# EAGLE design SparkFun_GNSS_Timing-ZED-F9T (EAGLE 9.6.2)
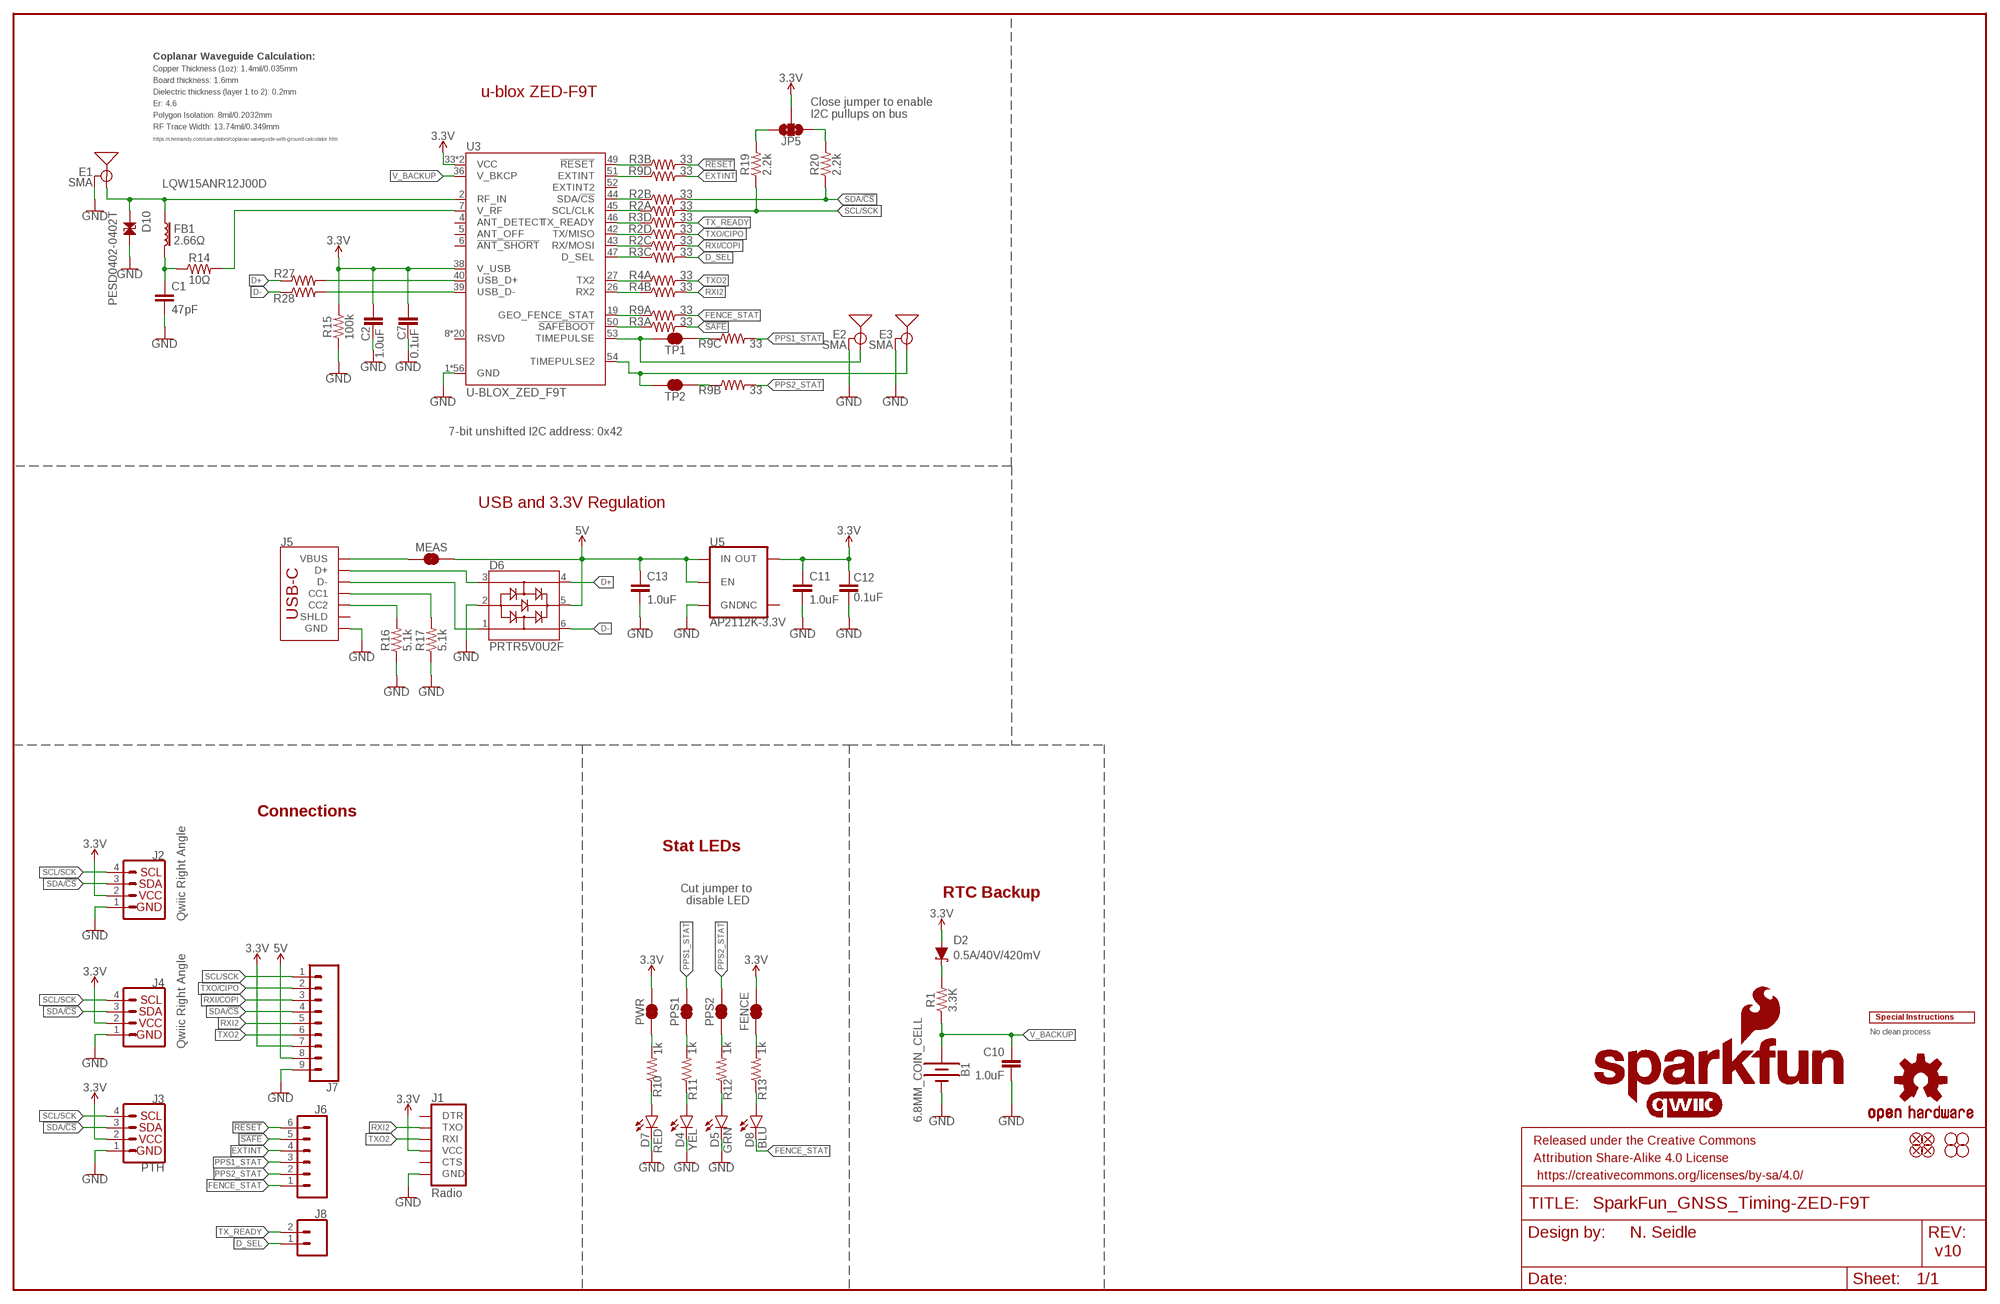
[diagram p0: schematic, sheet 1]

## Parts
B1  6.8MM_COIN_CELL  ML414H_IV01E_BATTERY  [ML414H_IV01E]
C1  47pF  47PF-0402_TIGHT-25V-5%-X7R  [0402-TIGHT]
C2  1.0uF  1.0UF-0402T-16V-10%  [0402-TIGHT]
C7  0.1uF  0.1UF-0402T-16V-10%  [0402-TIGHT]
C10  1.0uF  1.0UF-0402T-16V-10%  [0402-TIGHT]
C11  1.0uF  1.0UF-0402T-16V-10%  [0402-TIGHT]
C12  0.1uF  0.1UF-0402T-6.3V-10%-X7R  [0402-TIGHT]
C13  1.0uF  1.0UF-0402T-16V-10%  [0402-TIGHT]
D2  0.5A/40V/420mV  DIODE-SCHOTTKY-PMEG4005EJ  [SOD-323]
D4  YEL  LED-YELLOW0603  [LED-0603]
D5  GRN  LED-GREEN0603  [LED-0603]
D6  PRTR5V0U2F  [SOT886]
D7  RED  LED-RED0603  [LED-0603]
D8  BLU  LED-BLUE0603  [LED-0603]
D10  PESD0402-0402T  [0402-TIGHT]
E1  SMA  ANTENNA-SMA-GROUNDEDEDGE_SMA  [SMA-EDGE]
E2  SMA  ANTENNA-SMA-GROUNDEDEDGE_SMA  [SMA-EDGE]
E3  SMA  ANTENNA-SMA-GROUNDEDEDGE_SMA  [SMA-EDGE]
FB1  2.66Ω  FERRITE_BEAD-0402-2.66Ω-1GHZ  [0402-TIGHT]
FENCE  JUMPER-SMT_2_NC_TRACE_SILK  [SMT-JUMPER_2_NC_TRACE_SILK]
FRAME2  FRAME-LEDGER  [CREATIVE_COMMONS]
H1  STAND-OFF  [STAND-OFF]
H2  STAND-OFF  [STAND-OFF]
H3  STAND-OFF  [STAND-OFF]
H4  STAND-OFF  [STAND-OFF]
J1  Radio  6_PIN_SERIAL_TARGET_NO_SILK  [1X06_NO_SILK]
J2  Qwiic Right Angle  I2C_STANDARDQWIIC  [JST04_1MM_RA]
J3  PTH  I2C_STANDARD_NO_SILK  [1X04_NO_SILK]
J4  Qwiic Right Angle  I2C_STANDARDQWIIC  [JST04_1MM_RA]
J5  USB Female Type C Connector  USB_C_4-LAYER_PADS  [USB-C-16P_4LAYER-PADS]
J6  CONN_06NO_SILK_FEMALE_PTH  [1X06_NO_SILK]
J7  CONN_09NO_SILK  [1X09_NO_SILK]
J8  CONN_021X02_NO_SILK  [1X02_NO_SILK]
JP5  JUMPER-SMT_3_NO_SILK  [SMT-JUMPER_3_NO_SILK]
JP21  FIDUCIALUFIDUCIAL  [FIDUCIAL-MICRO]
JP61  FIDUCIALUFIDUCIAL  [FIDUCIAL-MICRO]
JP71  FIDUCIALUFIDUCIAL  [FIDUCIAL-MICRO]
JP81  FIDUCIALUFIDUCIAL  [FIDUCIAL-MICRO]
LOGO1  OSHW-LOGOMINI  [OSHW-LOGO-MINI]
LOGO2  SFE_LOGO_NAME_FLAME.1_INCH  [SFE_LOGO_NAME_FLAME_.1]
LOGO4  QWIIC_LOGO_4MM  [QWIIC_4MM]
LOGO5  SFE_LOGO_NAME.1_INCH  [SFE_LOGO_NAME_.1]
MEAS  JUMPER-COMBO_2_NC_TRACE  [COMBO-JUMPER_2_NC_TRACE]
PPS1  JUMPER-SMT_2_NC_TRACE_SILK  [SMT-JUMPER_2_NC_TRACE_SILK]
PPS2  JUMPER-SMT_2_NC_TRACE_SILK  [SMT-JUMPER_2_NC_TRACE_SILK]
PWR  JUMPER-SMT_2_NC_TRACE_SILK  [SMT-JUMPER_2_NC_TRACE_SILK]
R1  3.3K  3.3KOHM-0402T-1/16W-1%  [0402-TIGHT]
R2  33  33OHM_RA-1206-1/16W-5%  [1206_RA]
R3  33  33OHM_RA-1206-1/16W-5%  [1206_RA]
R4  33  33OHM_RA-1206-1/16W-5%  [1206_RA]
R9  33  33OHM_RA-1206-1/16W-5%  [1206_RA]
R10  1k  1KOHM-0402T-1/16W-1%  [0402-TIGHT]
R11  1k  1KOHM-0402T-1/16W-1%  [0402-TIGHT]
R12  1k  1KOHM-0402T-1/16W-1%  [0402-TIGHT]
R13  1k  1KOHM-0402T-1/16W-1%  [0402-TIGHT]
R14  10Ω  10OHM-0402-1/16W-5%  [0402-TIGHT]
R15  100k  100KOHM-0402T-1/16W-1%  [0402-TIGHT]
R16  5.1k  5.1KOHM-0402T-1/16W-1%  [0402-TIGHT]
R17  5.1k  5.1KOHM-0402T-1/16W-1%  [0402-TIGHT]
R19  2.2k  2.2KOHM-0402T-1/16W-1%  [0402-TIGHT]
R20  2.2k  2.2KOHM-0402T-1/16W-1%  [0402-TIGHT]
R27  27OHM  [0402-TIGHT]
R28  27OHM  [0402-TIGHT]
TP1  JUMPER-SMT_2_NC_TRACE_SILK  [SMT-JUMPER_2_NC_TRACE_SILK]
TP2  JUMPER-SMT_2_NC_TRACE_SILK  [SMT-JUMPER_2_NC_TRACE_SILK]
U3  U-BLOX_ZED_F9T  U-BLOX_ZED_F9RT  [ZED-F9X]
U5  AP2112K-3.3V  V_REG_AP2112K-3.3V  [SOT23-5]
U$2  SPECIAL_INSTRUCTIONS-ORDERING  [ORDERING_INSTRUCTIONS]

## Nets
3.3V [power]: C2.1 C7.2 C11.1 C12.2 D2.A FENCE.2 J1.4(VCC) J2.2 J3.2(VCC) J4.2 J7.7 JP5.2 PWR.2 R15.2 U3.33(VCC) U3.34(VCC) U3.38(V_USB) U5.5(OUT)
5V: C13.1 D6.5 J7.8 MEAS.2 MEAS.4 U5.1(IN) U5.3(EN)
!RESET!: J6.6 R3.P7
!RESET!_LV: R3.P2 U3.49(!RESET!)
!SAFE!: J6.5 R3.P8
!SAFE!_LV: R3.P1 U3.50(!SAFEBOOT!)
ANT_VCC: C1.1 FB1.2 R14.1
CC1: J5.A5(CC1) R17.2
CC2: J5.B5(CC2) R16.2
D+: D6.4 R27.1
D-: D6.6 R28.1
D_SEL: J8.1 R3.P6
DSEL_LV: R3.P3 U3.47(D_SEL)
EXTINT: J6.4 R9.P5
EXTINT_LV: R9.P4 U3.51(EXTINT)
FENCE_LV: R9.P1 U3.19(GEO_FENCE_STAT)
FENCE_STAT: D8.C J6.1 R9.P8
GND: B1.- C1.2 C2.2 C7.1 C10.2 C11.2 C12.1 C13.2 D4.C D5.C D6.2 D7.C D10.2 E1.GND@0(GND) E1.GND@1(GND) E1.GND@2(GND) E1.GND@3(GND) E2.GND@0(GND) E2.GND@1(GND) E2.GND@2(GND) E2.GND@3(GND) E3.GND@0(GND) E3.GND@1(GND) E3.GND@2(GND) E3.GND@3(GND) J1.6(GND) J2.1 J3.1(GND) J4.1 J5.GND J5.GND2(GND) J7.9 R15.1 R16.1 R17.1 U3.1(GND) U3.3(GND) U3.12(GND) U3.14(GND) U3.32(GND) U3.37(GND) U3.41(GND) U3.48(GND) U3.G1(GND) U3.G2(GND) U3.G3(GND) U3.G4(GND) U3.G5(GND) U3.G6(GND) U3.G7(GND) U3.G8(GND) U3.G9(GND) U3.G10(GND) U3.G11(GND) U3.G12(GND) U3.G13(GND) U3.G14(GND) U3.G15(GND) U3.G16(GND) U3.G17(GND) U3.G18(GND) U3.G19(GND) U3.G20(GND) U3.G21(GND) U3.G22(GND) U3.G23(GND) U3.G24(GND) U3.G25(GND) U3.G26(GND) U3.G27(GND) U3.G28(GND) U3.G29(GND) U3.G30(GND) U3.G31(GND) U3.G32(GND) U3.G33(GND) U3.G34(GND) U3.G35(GND) U3.G36(GND) U3.G37(GND) U3.G38(GND) U3.G39(GND) U3.G40(GND) U3.G41(GND) U3.G42(GND) U3.G43(GND) U3.G44(GND) U3.G45(GND) U3.G46(GND) U3.G47(GND) U3.G48(GND) U5.2(GND)
GPS_ANT1 [RF]: D10.1 E1.SIG(SIGNAL) FB1.1 U3.2(RF_IN)
N$2: D4.A R11.1
N$3: PPS1.1 R11.2
N$4 [power]: J5.VBUS1(VBUS) J5.VBUS2(VBUS) MEAS.1 MEAS.3
N$5: R9.P3 TP1.1
N$6: D2.C R1.2
N$7: R9.P2 TP2.1
N$11: R27.2 U3.40(USB_D+)
N$12: R28.2 U3.39(USB_D-)
N$13: R14.2 U3.7(V_RF)
N$14: D7.A R10.1
N$16: D5.A R12.1
N$17: PPS2.1 R12.2
N$18: D8.A R13.1
N$19: FENCE.1 R13.2
N$20: PWR.1 R10.2
N$21: JP5.1 R20.2
N$22: JP5.3 R19.2
PPS1_STAT: J6.3 PPS1.2 R9.P6
PPS2_STAT: J6.2 PPS2.2 R9.P7
RX1_LV: R2.P3 U3.43(RX/MOSI)
RX2_LV: R4.P2 U3.26(RX2)
RXI2: J1.3(TXO) J7.5 R4.P7
RXI/COPI: J7.3 R2.P6
SCL/SCK: J2.4 J3.4(SCL) J4.4 J7.1 R2.P8 R19.1
SCL_LV: R2.P1 U3.45(SCL/CLK)
SDA/!CS: J2.3 J3.3(SDA) J4.3 J7.4 R2.P7 R20.1
SDA_LV: R2.P2 U3.44(SDA/!CS!)
TP1_LV [RF]: E2.SIG(SIGNAL) TP1.2 U3.53(TIMEPULSE)
TP2_LV [RF]: E3.SIG(SIGNAL) TP2.2 U3.54(TIMEPULSE2)
TX1_LV: R2.P4 U3.42(TX/MISO)
TX2_LV: R4.P1 U3.27(TX2)
TX_READY: J8.2 R3.P5
TX_READY_LV: R3.P4 U3.46(TX_READY)
TXO2: J1.2(RXI) J7.6 R4.P8
TXO/CIPO: J7.2 R2.P5
UNP_D+: D6.3 J5.A6(D+) J5.B6(D+)
UNP_D-: D6.1 J5.A7(D-) J5.B7(D-)
V_BACKUP: B1.+ C10.1 R1.1 U3.36(V_BKCP)
Unconnected: J1.1(DTR) J1.5(CTS) J5.SHLD1(SHLD) J5.SHLD2(SHLD) J5.SHLD3(SHLD) J5.SHLD4(SHLD) R4.P3 R4.P4 R4.P5 R4.P6 U3.4(ANT_DETECT) U3.5(ANT_OFF) U3.6(!ANT_SHORT!) U3.8(RSVD) U3.9(RSVD) U3.10(RSVD) U3.11(RSVD) U3.13(RSVD) U3.15(RSVD) U3.16(RSVD) U3.17(RSVD) U3.18(RSVD) U3.20(RSVD) U3.21(RSVD) U3.22(RSVD) U3.23(RSVD) U3.24(RSVD) U3.25(RSVD) U3.28(RSVD) U3.29(RSVD) U3.30(RSVD) U3.31(RSVD) U3.35(RSVD) U3.52(EXTINT2) U5.4(NC)

## Notes on the sheet
- Coplanar Waveguide Calculation:
- Copper Thickness (1oz): 1.4mil/0.035mm
- Board thickness: 1.6mm
- u-blox ZED-F9T
- Dielectric thickness (layer 1 to 2): 0.2mm
- Er: 4.6
- Polygon Isolation: 8mil/0.2032mm
- Close jumper to enable
  I2C pullups on bus
- RF Trace Width: 13.74mil/0.349mm
- https://chemandy.com/calculators/coplanar-waveguide-with-ground-calculator.htm
- LQW15ANR12J00D
- 7-bit unshifted I2C address: 0x42
- USB and 3.3V Regulation
- Connections
- Stat LEDs
- RTC Backup
- Cut jumper to 
  disable LED
- No clean process
- N. Seidle
- v10

## Library data of the parts
B1 = SparkFun-Batteries:ML414H_IV01E_BATTERY: SEIKO ML414H-IV01E Reflowable Lithium Battery ML414H is a rechargeable, coin type battery with features such as Pb-free reflowable (Peak temperature: 260 C) and high temperature heat resistance. Battery Characteristics: 3.1V max voltage Voff is 2V 1mAH 3k series resistor with battery 72 hour charge time from 2.0-3.1V 2.3-2.8V initial charge; PROD_ID: BATT-14267
C1 = SparkFun-Capacitors:47PF: 47pF ceramic capacitors A capacitor is a passive two-terminal electrical component used to store electrical energy temporarily in an electric field.; PROD_ID: CAP-15063
C2 C10 C11 C13 = SparkFun-Capacitors:1.0UF: 1µF ceramic capacitors A capacitor is a passive two-terminal electrical component used to store electrical energy temporarily in an electric field.; PROD_ID: CAP-12417
C7 = SparkFun-Capacitors:0.1UF: 0.1µF ceramic capacitors A capacitor is a passive two-terminal electrical component used to store electrical energy temporarily in an electric field.; PROD_ID: CAP-12416
C12 = SparkFun-Capacitors:0.1UF: 0.1µF ceramic capacitors A capacitor is a passive two-terminal electrical component used to store electrical energy temporarily in an electric field.; PROD_ID: CAP-14993
D2 = SparkFun-DiscreteSemi:DIODE-SCHOTTKY: Schottky diode A Schottky diode is a semiconductor diode which has a low forward voltage drop and a very fast switching action.; PROD_ID: DIO-10955
D4 = SparkFun-LED:LED-YELLOW: Yellow SMD LED Used in manufacturing several products at SparkFun. Packages: 0603 - SMD 0603 package[Product Link] <http://www.kingbrightusa.com/product.asp?catalog_name=LED&product_id=APT1608SYCK> 0603 -SMART - SMART SMD 0603 package (more efficient/more expensive) [Product Link] <http://www.osram-os.com/osram_os/en/products/product-catalog/led-light-emitting-diodes/smartled-0603/ly-l29k/index.jsp> LilyPad - SMD1206 package[Product Datasheet] <https://www.sparkfun.com/datasheets/DevTools/LilyPad/Q150YUS4.pdf> SparkFun Products: Blynk Board <https://www.sparkfun.com/products/13794> IOIO-OTG <https://www.sparkfun.com/products/13613> XBee Explorer Serial <https://www.sparkfun.com/products/13225>; PROD_ID: DIO-09003; VALUE: Yellow
D5 = SparkFun-LED:LED-GREEN: Green SMD LED Used in manufacturing of various products at SparkFun Packages: 0603 - SMD 0603 package [Product Link] <http://www.futureelectronics.com/en/technologies/semiconductors/optoelectronics/leds/Pages/9894312-LTST-C190GKT.aspx?CrossPart=HSMG-C190&IM=0> LilyPad 1206 - SMD1206 LilyPad package [Product Link] <http://www.futureelectronics.com/en/Technologies/Product.aspx?ProductID=IN150NGHARVATEKCORPORATION2049943&IM=0> 1206 - SMD1206 package [Product Link] <http://www.futureelectronics.com/en/technologies/semiconductors/optoelectronics/leds/Pages/8315665-LTST-C150KGKT.aspx?IM=0> 1206 Bottom Mount -SMD 1206 Bottom Mount [Product Link] <http://www.digikey.com/product-detail/en/lite-on-inc/LTST-C230KGKT/160-1456-1-ND/386854> SparkFun Products: Pro Mini 328 -5V <https://www.sparkfun.com/products/821> RedBoard <https://www.sparkfun.com/products/12757> MP3 Trigger <https://www.sparkfun.com/products/13720> Makey Makey <https://www.sparkfun.com/products/11076>; PROD_ID: DIO-00821; VALUE: GREEN
D6 = SparkFun-IC-Power:PRTR5V0U2: A small ESD protection device. Most commonly used on USB D+/D- signals to protect large, expensive, or especially sensitive USB enabled devices.; PROD_ID: DIO-14084
D7 = SparkFun-LED:LED-RED: Red SMD LED Used in manufacturing of most products at SparkFun Packages: 0603 - SMD 0603 package [Product Link] <http://docs.avagotech.com/docs/AV02-0551EN> 0603 SMART - SMD 0603 SMART package ( more efficient and expensive)[Product Link] <http://www.osram-os.com/Graphics/XPic2/00077099_0.pdf> 1206 - SMD1206 package [Product Link] <https://www.sparkfun.com/datasheets/DevTools/LilyPad/Q150OVS4.pdff> SparkFun Products: Pro Mini 328 -5V <https://www.sparkfun.com/products/821> RedBoard <https://www.sparkfun.com/products/12757> IOIO-OTG <https://www.sparkfun.com/products/13613>; PROD_ID: DIO-00819
D8 = SparkFun-LED:LED-BLUE: Blue SMD LED Used in manufacturing of various products at SparkFun Packages: 0603 - SMD 0603 package [Product Link] <http://www.digikey.com/product-detail/en/SMLE12BC7TT86/511-1589-2-ND/1641808> 1206 - SMD1206 package [Product Link] <http://www.digikey.com/product-detail/en/lite-on-inc/LTST-C150TBKT/160-1643-1-ND/573584> SparkFun Products: ESP8266 Thing-Dev Board <https://www.sparkfun.com/products/13711> RedBoard <https://www.sparkfun.com/products/12757>; PROD_ID: DIO-08575; VALUE: BLUE
D10 = SparkFun-DiscreteSemi:PESD0402: ESD protection diode PESD is used to protect a signal line from ESD.; PROD_ID: DIO-15359
E1-E3 = SparkFun-RF:ANTENNA-SMA-GROUNDED: SMA Antenna Connector w/ Ground Edge-mount and SMD SMA connectors for RF Antennas. **4-LAYER BOARD WARNING!!** When designing a 4-layer board using any of the SMD variants, you will need to manually add a cutout polygon on any internal power layers to make sure that you don't end up with exposed copper around the edge of the routed hole for these connectors. Exposed power copper could then short to the connector body - and that would be bad. Why hasn't anyone added the cutout polygons directly to the connector footprint? Well, your internal layers (usually 2 and 15) may be covered with GND polygons and you might well want the copper to go all the way to the edge, especially under the connector SIGNAL pin. So adding cutouts to the footprint might make matters worse, not better...; PROD_ID: CONN-08289
FB1 = SparkFun-Coils:FERRITE_BEAD: Ferrite Bead (blocks, cores, rings, chokes, etc.) Inductor with layers of ferrite used to suppress high frequencies. Often used to isolate high frequency noise. SparkFun Products: IOIO-OTG - V2.2 <https://www.sparkfun.com/products/13613> SparkFun SAMD21 Mini Breakout <https://www.sparkfun.com/products/13664> SparkFun 6 Degrees of Freedom Breakout - LSM6DS3 <https://www.sparkfun.com/products/13339> SparkFun SAMD21 Dev Breakout <https://www.sparkfun.com/products/13672>; PROD_ID: NDUC-15072
FENCE PPS1 PPS2 PWR TP1 TP2 = SparkFun-Jumpers:JUMPER-SMT_2_NC_TRACE: Normally closed trace jumper This jumper has a trace between two pads so it's normally closed (NC). Use a razor knife to open the connection. For best results follow the IPC guidelines for cutting traces: Cutout at least 0.063 mm (0.005 in). Remove all loose material to clean up the cut area. Seal the cut with an approved epoxy. Reapply solder to reclose the connection.
FRAME2 = SparkFun-Aesthetics:FRAME-LEDGER: Schematic Frame - Ledger Standard 11x14 US Ledger frame
H1-H4 = SparkFun-Hardware:STAND-OFF: Stand Off Drill holes for mechanically mounting via screws, standoffs, etc. Note: Use the keepout ring to avoid running the screw head into surrounding components. Variant Overviews STAND-OFF - Mechanical footprint for a #4 phillips button head screw. STAND-OFF-TIGHT - Mechanical footprint for a #4 phillips button head screw, Example SparkFun Products Screw - Phillips Head (1/4", 4-40, 10 pack) <https://www.sparkfun.com/products/10453> (PRT-10453) Screw - Phillips Head (1/2", 4-40, 10 pack) <https://www.sparkfun.com/products/10452> (PRT-10452) Screw - Phillips Head (3/4", 4-40, 10 pack) <https://www.sparkfun.com/products/10451> (PRT-10451) Screw - Phillips Head (1", 4-40, 10 pack) <https://www.sparkfun.com/products/10450> (PRT-10450)
J1 = SparkFun-Connectors:6_PIN_SERIAL_TARGET: 6-pin header connection for use with the "FTDI BASIC" pinout - TARGET SIDE. Also known as "Arduino Serial Program Header". It is used to mate with our FTDI Basic serial programmers using the Arduino IDE. Note, this device has "TARGET" in the name. It is intended to be used on a design that contains a target micro-controller that you wish to program. The "sister" device, named "CABLE" is inteneded to be used on a design that usually lives on the end of your USB cable and prvides the converter chip (FTDI232 or FTDI231x) to commnicate serial RX/TX. You can populate with some of these: Break Away Headers - Straight <https://www.sparkfun.com/products/116> (PRT-00116) For reference (or to suit your programming needs) check out these designs: SparkFun FTDI Basic Breakout - 5V <https://www.sparkfun.com/products/9716> (DEV-09716) SparkFun FTDI Basic Breakout - 3.3V <https://www.sparkfun.com/products/9873> (DEV-09873) SparkFun FTDI SmartBasic <https://www.sparkfun.com/products/12935> (DEV-12935) SparkFun Beefy 3 - FTDI Basic Breakout <https://www.sparkfun.com/products/13746> (DEV-13746)
J2 J4 = SparkFun-Connectors:I2C_STANDARD: SparkFun I2C Standard Pinout Header SparkFun has standardized on a pinout for all I2C based sensor breakouts. This pinout allows I2C boards to be plugged directly into the headers on Arduino Uno compatible boards, and to be daisy chained easily. Example SparkFun Products: SparkFun Atmospheric Sensor Breakout - BME280 <https://www.sparkfun.com/products/13676> SparkFun Altitude/Pressure Sensor Breakout - MPL3115A2 <https://www.sparkfun.com/products/11084> SparkFun TOF Range Finder Sensor - VL6180 <https://www.sparkfun.com/products/12785>; PROD_ID: CONN-13694
J3 = SparkX:I2C_STANDARD: SparkFun I2C Standard Pinout Header SparkFun has standardized on a pinout for all I2C based sensor breakouts. This pinout allows I2C boards to be plugged directly into the headers on Arduino Uno compatible boards, and to be daisy chained easily. Example SparkFun Products: SparkFun Atmospheric Sensor Breakout - BME280 <https://www.sparkfun.com/products/13676> SparkFun Altitude/Pressure Sensor Breakout - MPL3115A2 <https://www.sparkfun.com/products/11084> SparkFun TOF Range Finder Sensor - VL6180 <https://www.sparkfun.com/products/12785>
J5 = SparkFun-Connectors:USB_C: USB Type C 16Pin Connector Super Speed pins not available on the 16-pin purely SMD connector so this part is best for USB 2.0 implementations. D1 and D2 are tied together enabling D+/- no matter which way the cable is plugged into the connector. The two channel configuration pins (CC1/2) are exposed. These are normally connected to ground via 5.1k resistors but can be reconfigured for high current/high power applications. **4-LAYER BOARD WARNING!!** If designing 4-layer board, make sure to select the variant _4-LAYER-ISOLATED. The linked footprint (USB-C-16-4LAYER-ISOLATED) includes some very necessary cutout polygons in the inner layers (2 and 15). This prevents the PTH mounting shield legs on the USB connector from electrically connecting any other polygons on the inner layers (usually VCC and GND).; PROD_ID: CONN-14122
J6 = SparkFun-Connectors:CONN_06: Multi connection point. Often used as Generic Header-pin footprint for 0.1 inch spaced/style header connections On any of the 0.1 inch spaced packages, you can populate with these: Break Away Headers - Straight <https://www.sparkfun.com/products/116> (PRT-00116) Break Away Male Headers - Right Angle <https://www.sparkfun.com/products/553> (PRT-00553) Female Headers <https://www.sparkfun.com/products/115> (PRT-00115) Break Away Headers - Machine Pin <https://www.sparkfun.com/products/117> (PRT-00117) Break Away Female Headers - Swiss Machine Pin <https://www.sparkfun.com/products/743> (PRT-00743) Arduino Stackable Header - 6 Pin <https://www.sparkfun.com/products/9280> (PRT-09280) For SCREWTERMINALS and SPRING TERMINALS visit here: Screw Terimnals on SparkFun.com <https://www.sparkfun.com/search/results?term=Screw+Terminals> (5mm/3.5mm/2.54mm spacing) This device is also useful as a general connection point to wire up your design to another part of your project. Our various solder wires solder well into these plated through hole pads. Hook-Up Wire - Assortment (Stranded, 22 AWG) <https://www.sparkfun.com/products/11375> (PRT-11375) Hook-Up Wire - Assortment (Solid Core, 22 AWG) <https://www.sparkfun.com/products/11367> (PRT-11367) View the entire wire category on our website here <https://www.sparkfun.com/categories/141>; PROD_ID: CONN-08437
J7 = SparkFun-Connectors:CONN_09: Multi connection point. Often used as Generic Header-pin footprint for 0.1 inch spaced/style header connections On any of the 0.1 inch spaced packages, you can populate with these: Break Away Headers - Straight <https://www.sparkfun.com/products/116> (PRT-00116) Break Away Male Headers - Right Angle <https://www.sparkfun.com/products/553> (PRT-00553) Female Headers <https://www.sparkfun.com/products/115> (PRT-00115) Break Away Headers - Machine Pin <https://www.sparkfun.com/products/117> (PRT-00117) Break Away Female Headers - Swiss Machine Pin <https://www.sparkfun.com/products/743> (PRT-00743) For SCREWTERMINALS and SPRING TERMINALS visit here: Screw Terimnals on SparkFun.com <https://www.sparkfun.com/search/results?term=Screw+Terminals> (5mm/3.5mm/2.54mm spacing) This device is also useful as a general connection point to wire up your design to another part of your project. Our various solder wires solder well into these plated through hole pads. Hook-Up Wire - Assortment (Stranded, 22 AWG) <https://www.sparkfun.com/products/11375> (PRT-11375) Hook-Up Wire - Assortment (Solid Core, 22 AWG) <https://www.sparkfun.com/products/11367> (PRT-11367) View the entire wire category on our website here <https://www.sparkfun.com/categories/141> Special notes: Molex polarized connector foot print use with SKU : PRT-08231 with associated crimp pins and housings. 1MM SMD Version SKU: PRT-10208 NOTES ON THE VARIANTS LOCK and LOCK_LONGPADS... This footprint was designed to help hold the alignment of a through-hole component (i.e. 6-pin header) while soldering it into place. You may notice that each hole has been shifted either up or down by 0.005 of an inch from it's more standard position (which is a perfectly straight line). This slight alteration caused the pins (the squares in the middle) to touch the edges of the holes. Because they are alternating, it causes a "brace" to hold the component in place. 0.005 has proven to be the perfect amount of "off-center" position when using our standard breakaway headers. Although looks a little odd when you look at the bare footprint, once you have a header in there, the alteration is very hard to notice. Also,if you push a header all the way into place, it is covered up entirely on the bottom side.
J8 = SparkFun-Connectors:CONN_02: Multi connection point. Often used as Generic Header-pin footprint for 0.1 inch spaced/style header connections On any of the 0.1 inch spaced packages, you can populate with these: Break Away Headers - Straight <https://www.sparkfun.com/products/116> (PRT-00116) Break Away Male Headers - Right Angle <https://www.sparkfun.com/products/553> (PRT-00553) Female Headers <https://www.sparkfun.com/products/115> (PRT-00115) Break Away Headers - Machine Pin <https://www.sparkfun.com/products/117> (PRT-00117) Break Away Female Headers - Swiss Machine Pin <https://www.sparkfun.com/products/743> (PRT-00743) For SCREWTERMINALS and SPRING TERMINALS visit here: Screw Terimnals on SparkFun.com <https://www.sparkfun.com/search/results?term=Screw+Terminals> (5mm/3.5mm/2.54mm spacing) This device is also useful as a general connection point to wire up your design to another part of your project. Our various solder wires solder well into these plated through hole pads. Hook-Up Wire - Assortment (Stranded, 22 AWG) <https://www.sparkfun.com/products/11375> (PRT-11375) Hook-Up Wire - Assortment (Solid Core, 22 AWG) <https://www.sparkfun.com/products/11367> (PRT-11367) View the entire wire category on our website here <https://www.sparkfun.com/categories/141> Special notes: Molex polarized connector foot print use with: PRT-08233 with associated crimp pins and housings. 2.54_SCREWTERM for use with PRT-10571. 3.5mm Screw Terminal footprints for PRT-08084 5mm Screw Terminal footprints for use with PRT-08432
JP5 = SparkFun-Jumpers:JUMPER-SMT_3_NO: Normally open jumper This jumper has three pads in close proximity to each other. Apply solder to close the connection(s).
JP21 JP61 JP71 JP81 = SparkFun-Aesthetics:FIDUCIAL: Fiducial Alignment Points Point-of-reference for pick-and-place machines and other optical instruments.
LOGO1 = SparkFun-Aesthetics:OSHW-LOGO: Open-Source Hardware (OSHW) Logo This logo indicates the piece of hardware it is found on incorporates a OSHW license and/or adheres to the definition of open source hardware found here: http://freedomdefined.org/OSHW
LOGO2 = SparkFun-Aesthetics:SFE_LOGO_NAME_FLAME: SparkFun Font Logo w/ Flame This is the SparkFun full logo. The logo on the schematic will always be the same size; the package variant is the height of the flame part of the logo. Default layer for the logo on the board is tSilk.
LOGO4 = SparkFun-Aesthetics:QWIIC_LOGO: Qwiic Logos for placement on schematic and PCB. The 5.5mm silk logo is best for placing next to Qwiic connector.
LOGO5 = SparkFun-Aesthetics:SFE_LOGO_NAME: SparkFun Font Logo This is the SparkFun name logo. The logo on the schematic will always be the same size; the package variant is the height of the flame part of the logo (or the height the flame would be, if it were drawn). Default layer for the logo on the board is tSilk.
MEAS = SparkFun-Jumpers:JUMPER-COMBO_2_NC_TRACE
R1 = SparkFun-Resistors:3.3KOHM: 3.3kΩ resistor A resistor is a passive two-terminal electrical component that implements electrical resistance as a circuit element. Resistors act to reduce current flow, and, at the same time, act to lower voltage levels within circuits. - Wikipedia; PROD_ID: RES-15923
R2-R4 R9 = SparkFun-Resistors:33OHM_RA: EXB-38V330JV Four Resistory Array - AEC-Q200 Certified; PROD_ID: RES-15081
R10-R13 = SparkFun-Resistors:1KOHM: 1kΩ resistor A resistor is a passive two-terminal electrical component that implements electrical resistance as a circuit element. Resistors act to reduce current flow, and, at the same time, act to lower voltage levels within circuits. - Wikipedia; PROD_ID: RES-14342
R14 = SparkFun-Resistors:10OHM: 10Ω resistor A resistor is a passive two-terminal electrical component that implements electrical resistance as a circuit element. Resistors act to reduce current flow, and, at the same time, act to lower voltage levels within circuits. - Wikipedia; PROD_ID: RES-16072
R15 = SparkFun-Resistors:100KOHM: 100kΩ resistor A resistor is a passive two-terminal electrical component that implements electrical resistance as a circuit element. Resistors act to reduce current flow, and, at the same time, act to lower voltage levels within circuits. - Wikipedia; PROD_ID: RES-13495
R16 R17 = SparkFun-Resistors:5.1KOHM; PROD_ID: RES-14340
R19 R20 = SparkFun-Resistors:2.2KOHM: 2.2kΩ resistor A resistor is a passive two-terminal electrical component that implements electrical resistance as a circuit element. Resistors act to reduce current flow, and, at the same time, act to lower voltage levels within circuits. - Wikipedia; PROD_ID: RES-14341
R27 R28 = SparkFun-Resistors:27OHM: 27Ω resistor A resistor is a passive two-terminal electrical component that implements electrical resistance as a circuit element. Resistors act to reduce current flow, and, at the same time, act to lower voltage levels within circuits. - Wikipedia; PROD_ID: RES-15238
U3 = ZED-F9T:U-BLOX_ZED_F9R: u-blox ZED-F9T GNSS receiver designed for high precision timing applications.; PROD_ID: IC-16292
U5 = SparkFun-IC-Power:V_REG_AP2112: AP2112 - 600mA CMOS LDO Regulator w/ Enable The AP2112 is CMOS process low dropout linear regulator with enable function, the regulator delivers a guaranteed 600mA (min.) continuous load current. Features Output Voltage Accuracy: ±1.5% Output Current: 600mA (Min.) Foldback Short Current Protection: 50mA Enable Function to Turn ON/OFF VOUT Low Dropout Voltage (3.3V): 250mV (Typ.) @IOUT=600mA Excellent Load Regulation: 0.2%/A (Typ.) Excellent Line Regulation: 0.02%/V (Typ.) Low Quiescent Current: 55μA (Typ.) Low Standby Current: 0.01μA (Typ.) Low Output Noise: 50μVRMS PSRR: 100Hz -65dB, 1kHz -65dB OTSD Protection Stable with 1.0μF Flexible Cap: Ceramic, Tantalum and Aluminum Electrolytic Operation Temperature Range: -40°C to 85°C ESD: MM 400V, HBM 4000V; PROD_ID: VREG-12457; VALUE: 3.3V
U$2 = SparkFun-Aesthetics:SPECIAL_INSTRUCTIONS: Special Ordering/Production Instructions Alert Symbol for special PCB ordering instructions or unique production process warnings. Ordering Instructions Production Instructions Types of information that should be added to box: Copper weight Soldermask color Silk color PCB thickness Number of layers PCB Standard: 1.6mm FR4 1 oz copper immersion silver plating red soldermask white silkscreen Types of information that should be added to box: Special wash requirements Depaneling instructions Humidification Glue curing Default text settings: 0.07 inch 9% ratio 50% line distance

## Net classes
1 power: width 0.178 mm
2 3.3V: width 0.508 mm, drill 0.305 mm
3 RF: width 0.349 mm, clearance 0.203 mm

## Board
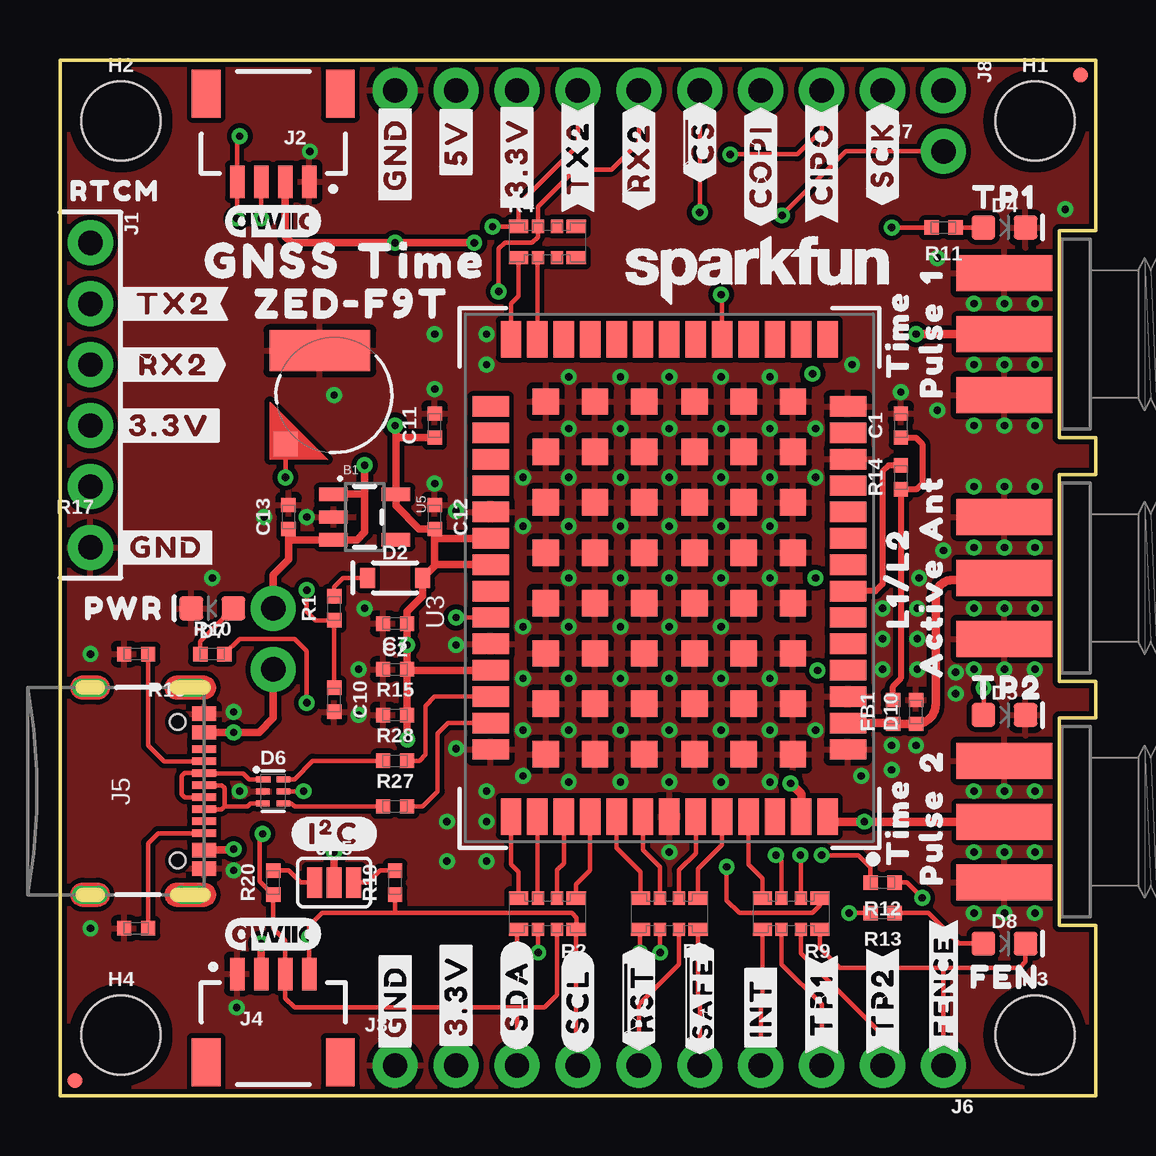
[diagram p1: board, top side]
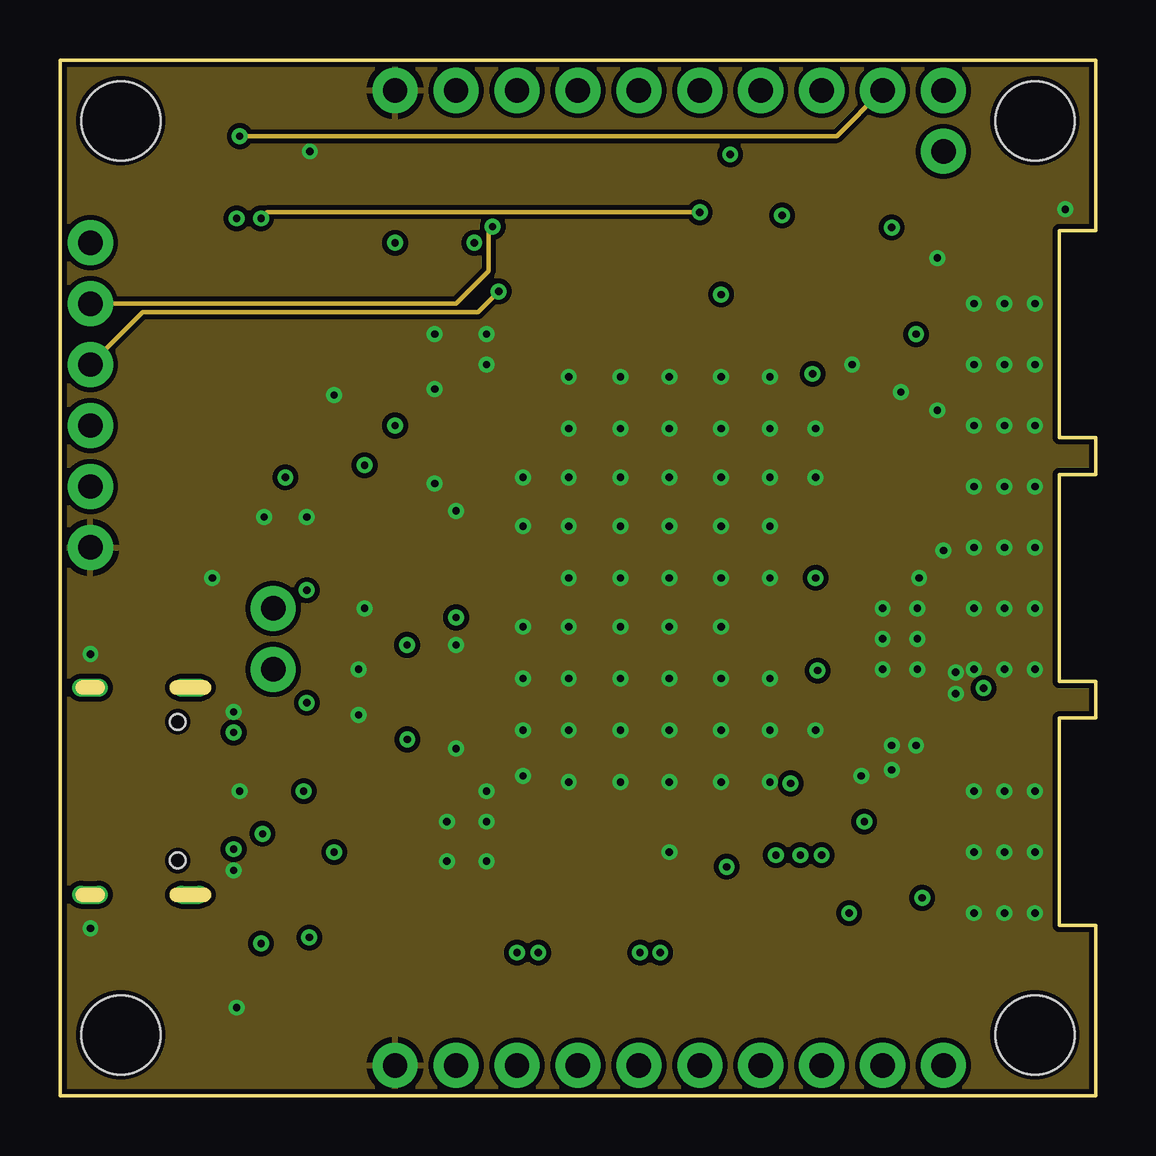
[diagram p2: board, inner layer GND/Horz]
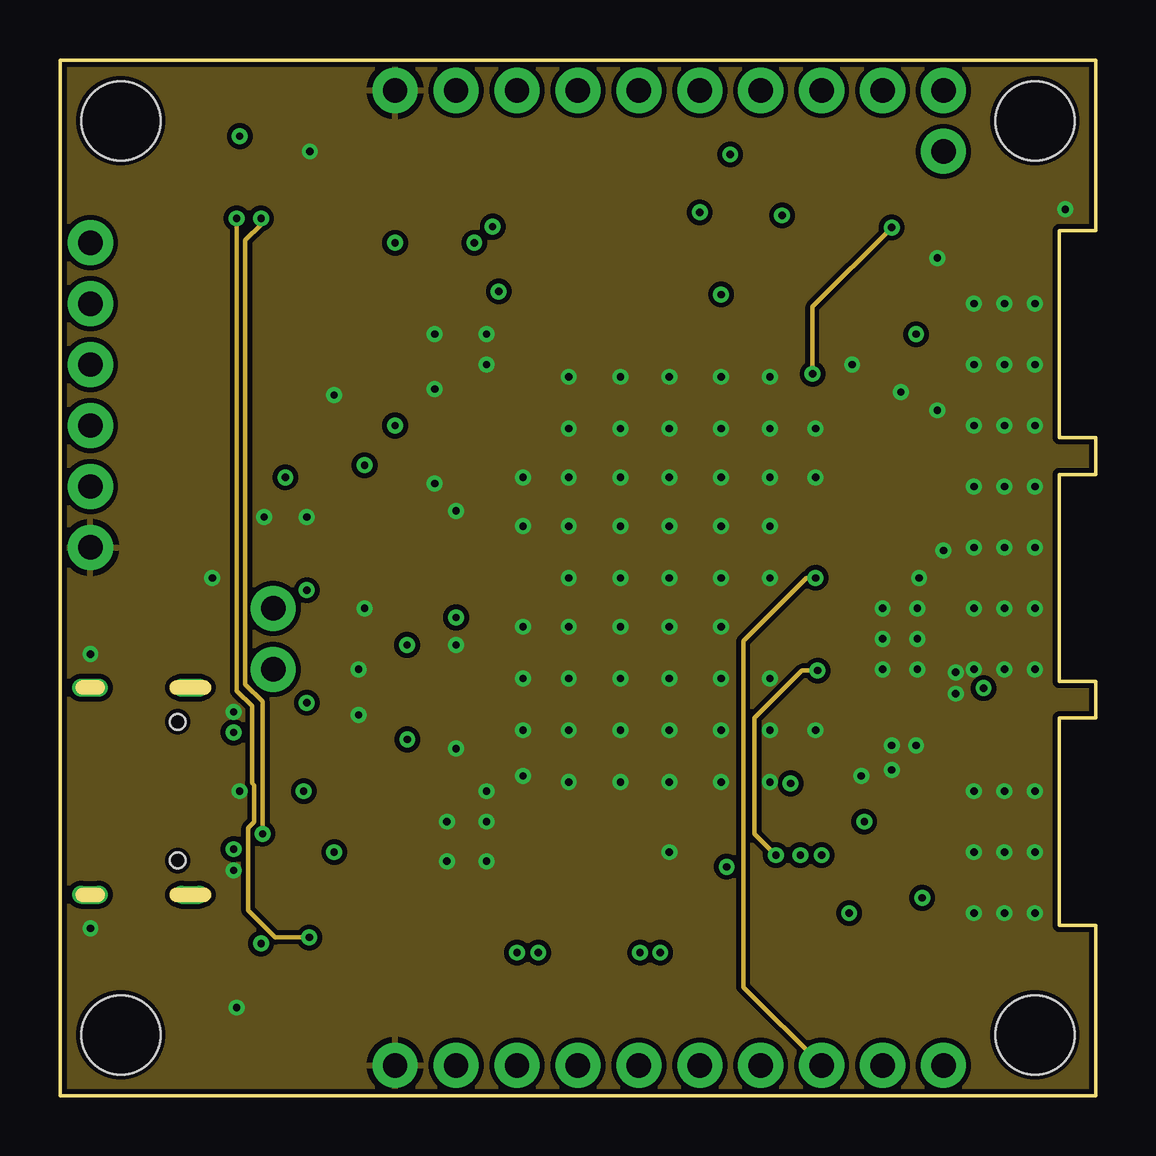
[diagram p3: board, inner layer Vert]
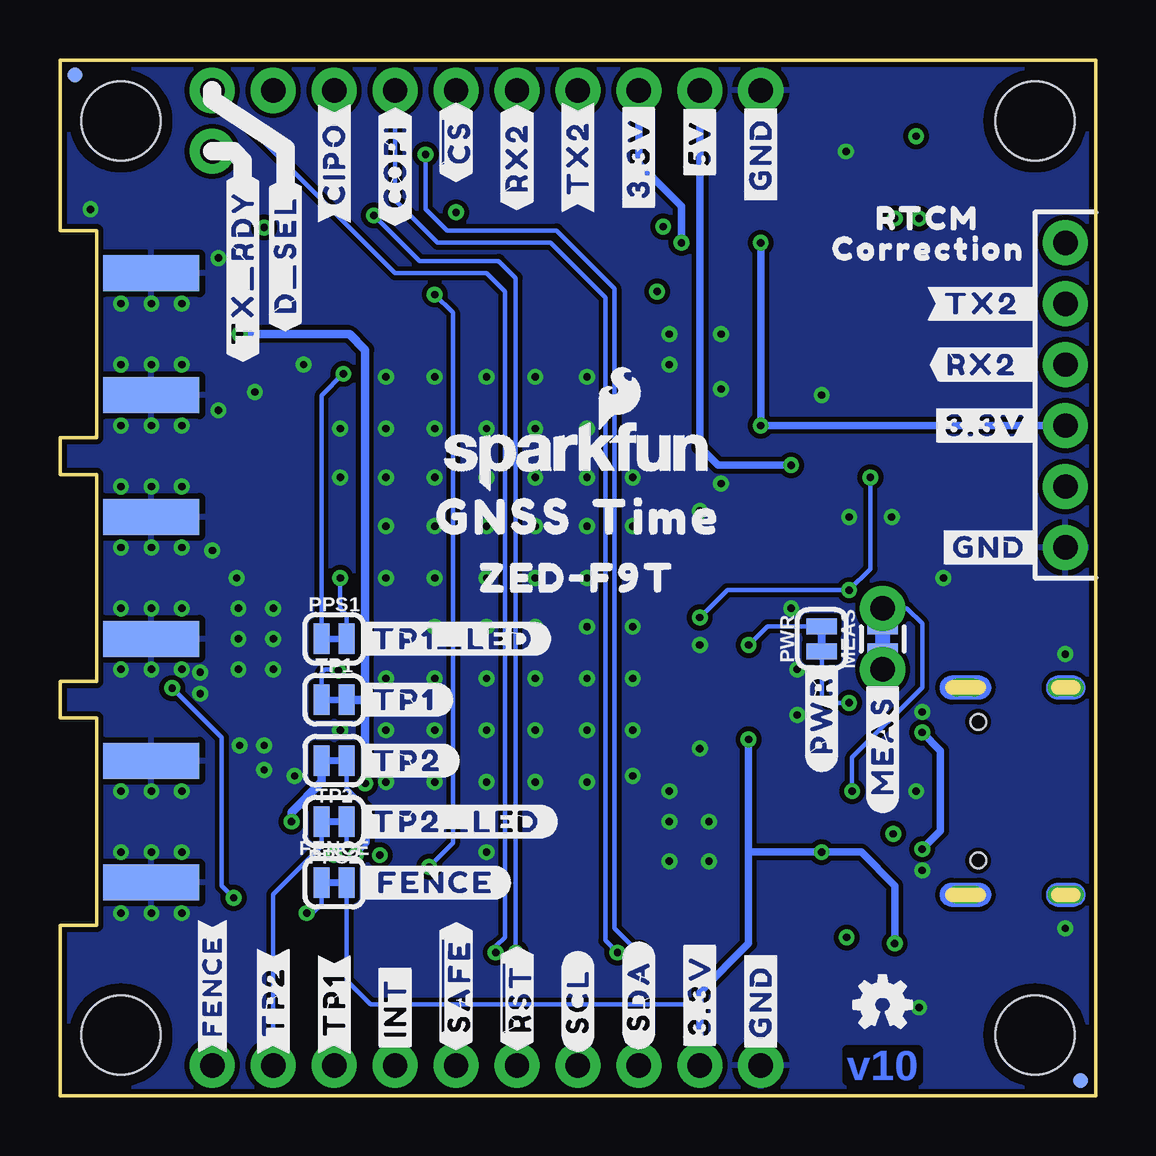
[diagram p4: board, bottom side, seen from below]

Size 43.18 x 43.18 mm. Coordinates in mm from the lower left corner, seen from the top.
Outline: 0,0 0,43.18 43.18,43.18 43.18,36.07 41.66,36.07 41.66,27.43 43.18,27.43 43.18,25.91 41.66,25.91 41.66,17.27 43.18,17.27 43.18,15.75 41.66,15.75 41.66,7.11 43.18,7.11 43.18,0 0,0
Copper layers (1+2*15+16): Top/Horz 0.035559375mm / dielectric 0.47751875mm / GND/Horz 0.035559375mm / dielectric 0.47751875mm / Vert 0.035559375mm / dielectric 0.47751875mm / Bottom/Vert 0.035559375mm
Design rules "SparkFun-4-Layer-General-JLCPCB": minimum track width 7mil, minimum drill 12mil, track to track 7mil, track to pad 7mil, pad to pad 7mil, via to via 7mil, smd to smd 7mil, copper to edge 7mil, drill to drill 7mil, minimum pad ring 7mil, minimum via ring 7mil, stop-mask expansion 3mil, vias tented up to drill 25mil, thermal gap 10mil

### Footprints (pad centres in the part's own frame; a part is rotated, then mirrored left to right if it is on the bottom)
ML414H_IV01E = smd 1 x 1: + 2.022,2.032 | smd 4.2 x 1.7: - 0.6,-1.85
0402-TIGHT = smd 0.6 x 0.6: 1 -0.5,0; 2 0.5,0
SOD-323 = smd 0.63 x 0.83: A 1.15,0; C -1.15,0
LED-0603 = smd 1 x 1: A -0.877,0; C 0.877,0
SOT886 = smd 0.61 x 0.25: 1 -0.405,0.5 | smd 0.56 x 0.25: 2 -0.43,0; 3 -0.43,-0.5; 4 0.43,-0.5; 5 0.43,0; 6 0.43,0.5
SMA-EDGE = smd 1.5 x 4: GND@0 -2.54,0; GND@1 2.54,0; SIG 0,0 | smd 1.5 x 4 bottom: GND@2 -2.54,0; GND@3 2.54,0
SMT-JUMPER_2_NC_TRACE_SILK = smd 0.66 x 1.27: 1 -0.521,0; 2 0.521,0
STAND-OFF = hole 3.302: 0,0
1X06_NO_SILK = drill 1.016 pad 1.88: 1 0,0; 2 2.54,0; 3 5.08,0; 4 7.62,0; 5 10.16,0; 6 12.7,0
JST04_1MM_RA = smd 0.6 x 1.35: 1 -1.5,0; 2 -0.5,0; 3 0.5,0; 4 1.5,0 | smd 1.2 x 2: NC1 2.8,-3.675; NC2 -2.8,-3.675
1X04_NO_SILK = drill 1.016 pad 1.88: 1 0,0; 2 2.54,0; 3 5.08,0; 4 7.62,0
USB-C-16P_4LAYER-PADS = smd 0.3 x 1: A5 -1.25,-0.34; A6 -0.25,-0.34; A7 0.25,-0.34; A8 1.25,-0.34; B5 1.75,-0.34; B6 0.75,-0.34; B7 -0.75,-0.34; B8 -1.75,-0.34 | smd 0.6 x 1: GND -3.225,-0.34; GND2 3.225,-0.34; VBUS1 -2.45,-0.34; VBUS2 2.45,-0.34 | drill 0.4 pad 0.6 long: SHLD1 -4.318,-0.915; SHLD2 4.318,-0.915; SHLD3 -4.318,-5.095; SHLD4 4.318,-5.095 | hole 0.65: -2.89,-1.445; 2.89,-1.445
1X09_NO_SILK = drill 1.016 pad 1.88: 1 0,0; 2 2.54,0; 3 5.08,0; 4 7.62,0; 5 10.16,0; 6 12.7,0; 7 15.24,0; 8 17.78,0; 9 20.32,0
1X02_NO_SILK = drill 1.016 pad 1.88: 1 0,0; 2 2.54,0
SMT-JUMPER_3_NO_SILK = smd 0.635 x 1.27: 1 -0.813,0; 2 0,0; 3 0.813,0
FIDUCIAL-MICRO = smd 0.635 x 0.635: 1 0,0
COMBO-JUMPER_2_NC_TRACE = smd 0.635 x 1.27: 1 -0.508,0; 2 0.508,0 | drill 1.016 pad 1.88: 3 -1.27,0; 4 1.27,0
1206_RA = smd 0.8 x 0.55: P1 -1.2,-0.62; P4 1.2,-0.62; P5 1.2,0.68; P8 -1.2,0.68 | smd 0.5 x 0.55: P2 -0.4,-0.62; P3 0.4,-0.62; P6 0.4,0.68; P7 -0.4,0.68
ZED-F9X = smd 0.85 x 1.52: 1 -7.15,-7.45; 2 -6.05,-7.45; 3 -4.95,-7.45; 4 -3.85,-7.45; 5 -2.75,-7.45; 6 -1.65,-7.45; 7 -0.55,-7.45; 8 0.55,-7.45; 9 1.65,-7.45; 10 2.75,-7.45; 11 3.85,-7.45; 12 4.95,-7.45; 13 6.05,-7.45; 14 7.15,-7.45; 28 7.15,7.45; 29 6.05,7.45; 30 4.95,7.45; 31 3.85,7.45; 32 2.75,7.45; 33 1.65,7.45; 34 0.55,7.45; 35 -0.55,7.45; 36 -1.65,7.45; 37 -2.75,7.45; 38 -3.85,7.45; 39 -4.95,7.45; 40 -6.05,7.45; 41 -7.15,7.45 | smd 1.52 x 0.85: 15 9.95,-6.6; 16 9.95,-5.5; 17 9.95,-4.4; 18 9.95,-3.3; 19 9.95,-2.2; 20 9.95,-1.1; 21 9.95,0; 22 9.95,1.1; 23 9.95,2.2; 24 9.95,3.3; 25 9.95,4.4; 26 9.95,5.5; 27 9.95,6.6; 42 -9.95,6.6; 43 -9.95,5.5; 44 -9.95,4.4; 45 -9.95,3.3; 46 -9.95,2.2; 47 -9.95,1.1; 48 -9.95,0; 49 -9.95,-1.1; 50 -9.95,-2.2; 51 -9.95,-3.3; 52 -9.95,-4.4; 53 -9.95,-5.5; 54 -9.95,-6.6 | smd 1.1 x 1.1: G1 -7.35,-5.15; G2 -5.25,-5.15; G3 -3.15,-5.15; G4 -1.05,-5.15; G5 1.05,-5.15; G6 3.15,-5.15; G7 5.25,-5.15; G8 7.35,-5.15; G9 7.35,-3.1; G10 5.25,-3.1; G11 3.15,-3.1; G12 1.05,-3.1; G13 -1.05,-3.1; G14 -3.15,-3.1; G15 -5.25,-3.1; G16 -7.35,-3.1; G17 -7.35,-1.05; G18 -5.25,-1.05; G19 -3.15,-1.05; G20 -1.05,-1.05; G21 1.05,-1.05; G22 3.15,-1.05; G23 5.25,-1.05; G24 7.35,-1.05; G25 7.35,1.05; G26 5.25,1.05; G27 3.15,1.05; G28 1.05,1.05; G29 -1.05,1.05; G30 -3.15,1.05; G31 -5.25,1.05; G32 -7.35,1.05; G33 -7.35,3.1; G34 -5.25,3.1; G35 -3.15,3.1; G36 -1.05,3.1; G37 1.05,3.1; G38 3.15,3.1; G39 5.25,3.1; G40 7.35,3.1; G41 7.35,5.15; G42 5.25,5.15; G43 3.15,5.15; G44 1.05,5.15; G45 -1.05,5.15; G46 -3.15,5.15; G47 -5.25,5.15; G48 -7.35,5.15
SOT23-5 = smd 0.55 x 1.2: 1 -0.95,-1.3; 2 0,-1.3; 3 0.95,-1.3; 4 0.95,1.3; 5 -0.95,1.3

### Placement (x,y rotation side)
B1  11.43,29.21 180 top
C1  35.05,27.94 90 top
C2  13.97,19.68 180 top
C7  13.97,17.78 0 top
C10  11.43,16.51 270 top
C11  15.62,27.94 90 top
C12  15.62,24.13 270 top
C13  9.53,24.13 90 top
D2  13.97,21.59 0 top
D4  39.37,36.2 0 top
D5  39.37,15.88 0 top
D6  8.89,12.7 0 top
D7  6.35,20.32 180 top
D8  39.37,6.35 0 top
D10  35.69,16 90 top
E1  39.37,21.59 270 top
E2  39.37,31.75 270 top
E3  39.37,11.43 270 top
FB1  34.73,16 90 top
FENCE  31.75,8.89 0 bottom
FRAME2  -9.09,-12.7 0 top  (outside the outline)
H1  40.64,40.64 0 top
H2  2.54,40.64 0 top
H3  40.64,2.54 0 top
H4  2.54,2.54 0 top
J1  1.27,35.56 270 top
J2  8.89,38.1 180 top
J3  13.97,1.27 0 top
J4  8.89,5.08 0 top
J5  6.35,12.7 270 top
J6  36.83,1.27 180 top
J7  34.29,41.91 180 top
J8  36.83,41.91 270 top
JP5  11.43,8.89 0 top
JP21  42.55,42.55 0 top
JP61  0.64,0.64 0 top
JP71  42.55,42.55 0 bottom
JP81  0.64,0.64 0 bottom
LOGO1  8.89,3.81 0 bottom
LOGO2  21.59,26.67 0 bottom
LOGO3  QWIIC_LOGO_4MM  [QWIIC_4MM]  8.89,36.45 0 top
LOGO4  8.89,6.73 0 top
LOGO5  29.08,34.42 0 top
MEAS  8.89,19.05 90 bottom
PPS1  31.75,19.05 0 bottom
PPS2  31.75,11.43 180 bottom
PWR  11.43,19.05 90 bottom
R1  11.43,20.32 90 top
R2  20.32,7.62 180 top
R3  25.4,7.62 180 top
R4  20.32,35.56 0 top
R9  30.48,7.62 180 top
R10  6.35,18.41 0 top
R11  36.83,36.2 180 top
R12  34.29,8.89 180 top
R13  34.29,7.62 180 top
R14  35.05,25.78 90 top
R15  13.97,15.88 0 top
R16  3.17,6.99 0 top
R17  3.17,18.41 0 top
R19  13.97,8.89 90 top
R20  8.89,8.89 90 top
R27  13.97,12.06 0 top
R28  13.97,13.97 0 top
TP1  31.75,16.51 0 bottom
TP2  31.75,13.97 180 bottom
U3  25.4,21.59 90 top
U5  12.7,24.13 270 top
U$1  [#3#3V#0]  19.05,39.12 90 top
U$2  60.96,50.8 0 top  (outside the outline)
U$3  [#5V#1]  16.51,39.75 90 top
U$4  [#GND#2]  13.97,39.24 90 top
U$5  [##CS##4]  26.67,39.75 90 top
U$6  [L1#L20]  34.92,21.59 90 top
U$7  [TIME0]  34.92,11.43 90 top
U$8  [##CS##4]  26.67,39.75 90 bottom
U$9  [#CIPO#6]  31.75,38.86 90 top
U$10  [#CIPO#6]  31.75,38.86 90 bottom
U$11  [#COPI#5]  29.21,38.73 90 top
U$12  [#COPI#5]  29.21,38.73 90 bottom
U$13  [ACTIVE1]  36.32,19.94 90 top
U$14  [#RX2#1]  24.13,39.12 90 top
U$15  [##RST##0]  24.13,4.06 90 top
U$16  [#RX2#1]  24.13,39.12 90 bottom
U$17  [#SCL#3]  21.59,3.94 90 bottom
U$18  [#SDA#2]  19.05,4.19 90 top
U$19  [PULSE1]  36.32,10.79 90 top
U$20  [12]  36.32,34.16 90 top
U$21  [TIME0]  34.92,31.75 90 top
U$22  [#SDA#2]  19.05,4.19 90 bottom
U$23  [#TX2#0]  21.59,39.12 90 top
U$24  [#TX2#0]  21.59,39.12 90 bottom
U$25  [PULSE1]  36.32,31.11 90 top
U$26  [20]  36.32,13.97 90 top
U$27  [#GND#2]  13.97,39.24 90 bottom
U$28  [#5V#1]  16.51,39.75 90 bottom
U$29  [#3#3V#0]  19.05,39.12 90 bottom
U$30  [#SCK#5]  34.29,39.24 90 top
U$31  [ANT1]  36.32,24.51 90 top
U$32  [#_TX2#0]  4.57,33.02 0 top
U$33  [#D_SEL#1]  33.78,35.05 90 bottom
U$34  [ZED#F9T0]  12.19,33.02 0 top
U$35  [#3#3V#0]  16.51,4.19 90 bottom
U$36  [#3#3V#0]  16.51,4.19 90 top
U$37  [##RST##0]  24.13,4.06 90 bottom
U$38  [#GND#2]  13.97,3.94 90 bottom
U$39  [#GND#2]  13.97,3.94 90 top
U$40  [GNSS0]  24.64,24.13 0 bottom
U$41  [##SAFE##1]  26.67,4.57 90 bottom
U$42  [#INT#2]  29.21,3.68 90 top
U$43  [#INT#2]  29.21,3.68 90 bottom
U$44  [#FENCE#0]  36.83,4.57 90 bottom
U$45  [#TP2_LED#0]  26.67,11.43 0 bottom
U$46  [#TP1#3]  31.75,3.81 90 top
U$47  [#TP1#3]  31.75,3.81 90 bottom
U$48  [#TP2#4]  34.29,3.94 90 top
U$49  [#TP2#4]  34.29,3.94 90 bottom
U$50  [#TP2#0]  28.7,13.97 0 bottom
U$51  [#_FENCE#0]  27.69,8.89 0 bottom
U$52  [#TP1#0]  28.83,16.51 0 bottom
U$53  [#SCL#3]  21.59,3.94 90 top
U$54  [#TP1_LED#0]  26.8,19.05 0 bottom
U$55  [#_RX2#0]  4.57,30.48 0 top
U$56  [PWR0]  2.67,20.32 0 top
U$57  [#PWR#0]  11.43,15.88 90 bottom
U$58  [#RX2_#0]  4.57,30.48 0 bottom
U$59  [#3#3V#0]  4.57,27.94 0 bottom
U$60  [#3#3V#0]  4.57,27.94 0 top
U$61  [#GND#2]  4.45,22.86 0 bottom
U$62  [#GND#2]  4.45,22.86 0 top
U$63  [TP10]  39.37,37.47 0 top
U$64  [TP21]  39.5,17.02 0 top
U$65  [#FENCE#0]  36.83,4.57 90 top
U$66  [#TX2_#0]  4.57,33.02 0 bottom
U$67  [#TX_RDY#0]  35.56,34.54 90 bottom
U$68  [#MEAS#0]  8.89,14.61 90 bottom
U$69  [#I�C#0]  11.43,10.92 0 top
U$70  [GNSS0]  8.89,34.8 0 top
U$71  [TIME1]  15.11,34.8 0 top
U$72  [##SAFE##0]  26.67,4.06 90 top
U$73  [RTCM0]  2.29,37.72 0 top
U$74  [TIME1]  18.29,24.13 0 bottom
U$75  [CORRECTION1]  6.99,35.31 0 bottom
U$76  [RTCM_0]  6.86,36.58 0 bottom
U$77  [ZED#F9T0]  21.59,21.59 0 bottom
U$78  [FEN0]  39.37,4.95 0 top

### Tracks (layer width: path | path; a pad name or v marks a point on that pad's centre or on a via)
3.3V  (via drill 0.3)
  Top/Horz 0.305: C7.2 v14.47,18.8 C2.1 14.47,20.18 15.12,20.84 D2.A 15.67,22.14 | C7.2 R15.2 v14.47,14.87 v14.48,14.86 | U3.38 14.51,17.74 C7.2 | U3.34 15.67,22.14 | 15.62,23.24 C12.2 14.98,23.63 14,24.61 U5.5 14,27.43 | 15.62,23.24 15.62,22.19 15.67,22.14 | U3.33 15.62,23.24 | 14,27.43 14,27.91 v13.97,27.94 | J2.2 9.39,35.82 9.65,35.56 v13.97,35.56 v17.27,35.56 | J4.2 v8.39,6.34 v8.38,6.35 | JP5.2 v11.43,10.16 | C11.1 14,27.43
  Bottom/Vert 0.178: PWR.2 13.7,19.57 v14.47,18.8 | FENCE.2 31.23,4.81 30.23,3.81 16.51,3.81
  Bottom/Vert 0.305: v13.97,35.56 v13.97,27.94 J1.4 | v17.27,35.56 17.27,37.08 19.05,38.86 J7.7 | v8.38,6.35 8.38,8.76 9.78,10.16 v11.43,10.16 14.48,10.16 | 14.48,10.16 v14.48,14.86 | J3.2 16.51,3.81 16.51,4.32 14.48,6.35 14.48,10.16
5V  (via drill 0.3)
  Top/Horz 0.178: D6.5 v10.16,12.7
  Top/Horz 0.305: MEAS.4 8.89,21.72 9.53,22.35 9.53,23.24 | 9.53,23.24 C13.1 | 9.53,23.24 9.59,23.18 U5.3 12.38,23.18 12.7,23.5 12.7,25.15 | v12.7,26.29 12.7,25.15 | U5.1 12.63,25.08 12.7,25.15
  Bottom/Vert 0.178: MEAS.2 MEAS.4 7.87,20.32 7.24,19.68 7.24,17.02 10.16,14.1 v10.16,12.7
  Bottom/Vert 0.305: J7.8 16.51,27.05 15.75,26.29 v12.7,26.29
!RESET!
  Top/Horz 0.178: R3.P7 25.8,5.48 24.13,3.81 J6.6
!RESET!_LV
  Top/Horz 0.178: U3.49 26.5,10.12 25.8,9.42 R3.P2
!SAFE!
  Top/Horz 0.178: R3.P8 26.6,3.88 26.67,3.81 J6.5
!SAFE!_LV
  Top/Horz 0.178: U3.50 27.6,10.46 26.6,9.46 R3.P1
ANT_VCC
  Top/Horz 0.254: C1.1 35.68,27.44 35.94,27.18 35.94,25.53 35.7,25.28 R14.1 35.05,17.4 34.73,17.07 FB1.2
CC1
  Top/Horz 0.178: J5.A5 4.34,13.95 3.67,14.61 R17.2
CC2
  Top/Horz 0.178: J5.B5 4.09,10.95 3.67,10.53 R16.2
D+
  Top/Horz 0.178: D6.4 9.64,12.2 9.78,12.06 R27.1
D-
  Top/Horz 0.178: D6.6 9.77,13.2 10.54,13.97 R28.1
D_SEL  (via drill 0.3)
  Top/Horz 0.178: R3.P6 25,5.99 v25.02,5.97
  Bottom/Vert 0.178: v25.02,5.97 25.02,6.22 24.64,6.6 24.64,33.53 25.4,34.29 29.21,34.29 J8.1
DSEL_LV
  Top/Horz 0.178: U3.47 24.3,10.24 25,9.54 R3.P3
EXTINT
  Top/Horz 0.178: R9.P5 29.28,3.88 29.21,3.81 J6.4
EXTINT_LV
  Top/Horz 0.178: U3.51 28.7,9.65 29.28,9.07 R9.P4
FENCE_LV  (via drill 0.3)
  Top/Horz 0.178: U3.19 27.6,33.36 v27.56,33.4 | v27.79,9.55 27.79,8.15 28.32,7.62 31.37,7.62 31.68,7.93 R9.P1
  Bottom/Vert 0.178: v27.56,33.4 26.8,32.64 26.8,10.54 v27.79,9.55
FENCE_STAT
  Top/Horz 0.178: R9.P8 31.68,6.17 32.51,5.33 36.83,5.33 | D8.C 40.25,5.58 40.01,5.33 36.83,5.33 | J6.1 36.83,5.33
GND  (via drill 0.3)
  other vias: 7.49,12.7 16.13,9.78 17.78,11.43 17.78,12.7 21.21,13.08 21.21,15.24 21.21,17.4 21.21,19.56 21.21,21.59 21.21,23.75 21.21,25.78 21.21,27.81 21.21,29.97 23.37,13.08 23.37,15.24 23.37,17.4 23.37,19.56 23.37,21.59 23.37,23.75 23.37,25.78 23.37,27.81 23.37,29.97 25.4,13.08 25.4,15.24 25.4,17.4 25.4,19.56 25.4,21.59 25.4,23.75 25.4,25.78 25.4,27.81 25.4,29.97 27.56,13.08 27.56,15.24 27.56,17.4 27.56,19.56 27.56,21.59 27.56,23.75 27.56,25.78 27.56,27.81 27.56,29.97 29.59,13.08 29.59,15.24 29.59,17.4 29.59,21.59 29.59,23.75 29.59,25.78 29.59,27.81 29.59,29.97 17.78,30.48 17.78,31.75 33.02,30.48 12.45,17.78 12.45,15.88 12.7,20.32 8.51,24.13 10.29,24.13 15.62,25.53 16.51,24.38 15.62,29.46 11.43,29.21 31.5,27.81 31.5,25.78 19.3,23.75 19.3,25.78 19.3,19.56 19.3,17.4 19.3,13.34 19.3,15.24 34.29,17.78 31.5,15.24 1.27,6.99 1.27,18.41 7.24,9.4 7.24,16 6.35,21.59 10.41,39.37 7.37,3.68 35.69,14.61 37.34,17.65 34.67,14.61 39.37,17.78 40.64,17.78 38.1,17.78 38.1,20.32 39.37,20.32 40.64,20.32 40.64,22.86 39.37,22.86 38.1,22.86 38.1,25.4 39.37,25.4 40.64,25.4 40.64,27.94 39.37,27.94 38.1,27.94 38.1,30.48 39.37,30.48 40.64,30.48 40.64,33.02 39.37,33.02 38.1,33.02 41.91,36.96 35.74,19.05 35.74,20.32 35.81,21.59 36.83,22.73 34.29,20.32 35.05,29.34 16.51,18.8 16.51,14.48 17.78,9.78 16.13,11.43 15.62,31.75 40.64,7.62 39.37,7.62 39.37,10.16 40.64,10.16 38.1,10.16 38.1,12.7 39.37,12.7 40.64,12.7 34.67,13.59 33.4,13.34 34.29,19.05 36.58,34.92 36.58,28.57 35.74,17.78 25.4,10.16 37.34,16.76 38.1,7.62
  pour Top/Horz (isolate 0.203, rank 4): 0,43.18 0,0 43.18,0 43.18,43.18
  pour Bottom/Vert (isolate 0.203, rank 4): 43.18,43.18 43.18,0 0,0 0,43.18
  pour Vert (isolate 0.203, rank 4): 43.18,43.18 43.18,0 0,0 0,43.18
  pour GND/Horz (isolate 0.203, rank 4): 43.18,43.18 43.18,0 0,0 0,43.18
GPS_ANT1
  Top/Horz 0.349: U3.2 34.69,15.54 arc-90 FB1.1 D10.1 arc90 36.5,16.32 36.5,20.8 arc-90 37.2,21.5 39.28,21.5 arc90 E1.SIG
N$2
  Top/Horz 0.178: D4.A R11.1
N$3  (via drill 0.3)
  Top/Horz 0.178: v34.67,36.2 R11.2
  Vert 0.178: v31.37,30.1 31.37,32.89 v34.67,36.2
  Bottom/Vert 0.178: PPS1.1 32.27,29.2 v31.37,30.1
N$4  (via drill 0.3)
  Top/Horz 0.305: J5.VBUS1 v7.24,15.15 8.29,15.15 8.89,15.75 MEAS.3 | J5.VBUS2 7.2,10.25 v7.24,10.29
  Bottom/Vert 0.178: MEAS.1 MEAS.3
  Bottom/Vert 0.305: v7.24,15.15 6.48,14.39 6.48,11.05 v7.24,10.29
N$5  (via drill 0.3)
  Top/Horz 0.178: R9.P3 30.08,9.8 v29.84,10.03
  Vert 0.178: v31.58,17.73 30.94,17.73 28.96,15.75 28.96,10.92 v29.84,10.03
  Bottom/Vert 0.178: TP1.1 32.27,17.64 32.13,17.78 31.63,17.78 v31.58,17.73
N$6
  Top/Horz 0.178: R1.2 11.43,21.21 11.81,21.59 D2.C
N$7  (via drill 0.3)
  Top/Horz 0.178: R9.P2 30.88,10.01 v30.86,10.03
  Bottom/Vert 0.178: v30.86,10.03 30.35,10.54 30.35,11.94 31.23,12.81 TP2.1
N$11
  Top/Horz 0.178: R27.2 15.11,12.06 15.75,12.7 15.75,15.11 16.18,15.54 U3.40
N$12
  Top/Horz 0.178: R28.2 14.99,13.97 15.24,14.22 15.24,16.26 15.62,16.64 U3.39
N$13
  Top/Horz 0.254: R14.2 34.54,26.28 34.29,26.04 34.29,21.34 33.99,21.04 U3.7
N$14
  Top/Horz 0.178: R10.1 5.85,18.93 7.23,20.31 D7.A
N$16  (via drill 0.3)
  Top/Horz 0.178: v35.94,8.26 35.31,8.89 R12.1 | v38.5,17 38.5,15.88 D5.A
  Bottom/Vert 0.178: v38.5,17 36.44,14.93 36.44,8.75 v35.94,8.26 | v35.94,8.26
N$17  (via drill 0.3)
  Top/Horz 0.178: v31.75,10.03 33.27,10.03 33.79,9.52 R12.2
  Bottom/Vert 0.178: v31.75,10.03 31.23,10.55 PPS2.1
N$18
  Top/Horz 0.178: R13.1 36.2,7.62 37.47,6.35 D8.A
N$19  (via drill 0.3)
  Top/Horz 0.178: v32.89,7.62 R13.2
  Bottom/Vert 0.178: v32.89,7.62 32.64,7.62 32.27,7.99 FENCE.1
N$20  (via drill 0.3)
  Top/Horz 0.178: R10.2 7.49,19.05 9.78,19.05 10.29,18.54 v10.29,16.38
  Bottom/Vert 0.178: v10.29,16.38 11.18,16.38 11.43,16.64 PWR.1
N$21
  Top/Horz 0.178: JP5.1 10.03,8.89 9.53,9.39 R20.2
N$22
  Top/Horz 0.178: JP5.3 12.84,8.89 13.34,9.39 R19.2
PPS1_STAT  (via drill 0.3)
  Top/Horz 0.178: R9.P6 30.08,5.48 31.75,3.81 J6.3
  Vert 0.178: J6.3 28.49,4.53 28.49,18.96 31.11,21.59 v31.5,21.59
  Bottom/Vert 0.178: v31.5,21.59 31.5,20.32 31.23,20.05 PPS1.2
PPS2_STAT
  Top/Horz 0.178: R9.P7 30.88,5.95 34.29,2.54 J6.2
  Bottom/Vert 0.178: J6.2 34.29,8.39 32.27,10.41 PPS2.2
RX1_LV
  Top/Horz 0.178: U3.43 19.9,8.26 R2.P3
RX2_LV
  Top/Horz 0.178: U3.26 19.9,34.92 R4.P2
RXI2  (via drill 0.3)
  Top/Horz 0.178: J7.5 24.13,39.75 22.99,38.61 21.46,38.61 19.92,37.06 R4.P7 19.92,35.8 19.68,35.56 18.54,35.56 18.29,35.31 v18.29,33.53
  GND/Horz 0.178: J1.3 3.45,32.66 17.42,32.66 v18.29,33.53
RXI/COPI  (via drill 0.3)
  Top/Horz 0.178: R2.P6 19.92,5.99 v19.94,5.97
  Bottom/Vert 0.178: v19.94,5.97 20.45,6.48 20.45,33.27 22.73,35.56 27.43,35.56 29.21,37.34 J7.3
SCL/SCK  (via drill 0.3)
  Top/Horz 0.178: J4.4 v10.39,6.6 10.39,7.09 10.92,7.62 13.97,7.62 | 13.97,7.62 21.34,7.62 21.53,7.42 21.53,6.93 R2.P8 21.52,1.34 J3.4 | R19.1 13.97,7.62 | v7.37,36.58 7.39,36.6 J2.4 7.39,39.9 v7.49,40.01
  GND/Horz 0.178: v7.49,40.01 32.38,40.01 J7.1
  Vert 0.178: v7.37,36.58 7.37,16.88 8,16.25 8,13.04 8.09,12.95 8.09,11.41 7.85,11.17 7.85,7.73 8.97,6.6 v10.39,6.6
SCL_LV
  Top/Horz 0.178: R2.P1 21.52,8.82 22.1,9.4 U3.45
SDA/!CS  (via drill 0.3)
  Top/Horz 0.178: R2.P7 20.72,4.21 20.19,3.68 19.05,3.68 | R20.1 8.89,6.99 9.39,6.49 J4.3 9.39,4.07 9.78,3.68 19.05,3.68 | R20.1 | J7.4 v26.67,36.83 | v8.38,36.58 J2.3 | J3.3 19.05,3.68 | v8.45,10.92 8.43,10.92 8.32,10.82 8.32,8.95 R20.1
  GND/Horz 0.178: v8.38,36.58 8.64,36.83 v26.67,36.83
  Vert 0.178: v8.38,36.58 8.38,36.32 7.72,35.66 7.72,17.16 8.45,16.43 v8.45,10.92
SDA_LV
  Top/Horz 0.178: U3.44 21,9.7 20.72,9.42 R2.P2
TP1_LV  (via drill 0.3)
  Top/Horz 0.35: v35.69,31.75 E2.SIG | U3.53 30.9,12.58 v30.45,13.03
  Bottom/Vert 0.35: v30.45,13.03 30.45,16.51 | 30.45,16.51 30.45,31.09 31.11,31.75 v35.69,31.75 | TP1.2 30.45,16.51
TP2_LV  (via drill 0.3)
  Top/Horz 0.35: E3.SIG v33.53,11.43 32.21,11.43 U3.54
  Bottom/Vert 0.35: TP2.2 32.27,13.08 33.53,11.82 v33.53,11.43
TX1_LV
  Top/Horz 0.178: U3.42 18.8,9.65 19.12,9.33 R2.P4
TX2_LV
  Top/Horz 0.178: U3.27 18.8,33.02 19.12,33.34 R4.P1
TX_READY  (via drill 0.3)
  Top/Horz 0.178: R3.P5 24.18,6.92 v24.18,5.97 | J8.2 32.77,39.37 v30.1,36.7
  Bottom/Vert 0.178: v24.18,5.97 24.18,34.09 24.89,34.8 28.19,34.8 v30.1,36.7
TX_READY_LV
  Top/Horz 0.178: U3.46 23.2,10.33 24.2,9.33 R3.P4
TXO2  (via drill 0.3)
  Top/Horz 0.178: J7.6 21.59,39.62 19.12,37.15 R4.P8 v18.03,36.23
  GND/Horz 0.178: J1.2 16.51,33.02 17.87,34.38 17.87,36.07 v18.03,36.23
TXO/CIPO  (via drill 0.3)
  Top/Horz 0.178: R2.P5 19.05,6.87 v19.05,5.97 | J7.2 31.75,40.26 30.73,39.24 v27.94,39.24
  Bottom/Vert 0.178: v19.05,5.97 20.07,6.99 20.07,33.66 22.48,36.07 27.05,36.07 27.94,36.96 v27.94,39.24
UNP_D+
  Top/Horz 0.178: J5.A6 6.74,12.95 6.86,12.83 6.86,12.06 | D6.3 7.95,12.2 7.82,12.06 6.86,12.06 | J5.B6 6.74,11.95 6.86,12.06
UNP_D-
  Top/Horz 0.178: D6.1 7.88,13.2 7.63,13.45 J5.B7 6,13.46 5.21,13.46 5.08,13.34 5.08,12.57 5.2,12.45 J5.A7
V_BACKUP  (via drill 0.3)
  Top/Horz 0.178: C10.1 R1.1 10.66,19.82 10.29,20.19 v10.29,21.08 | U3.36 v16.51,19.94 | B1.+ 9.41,25.79 v9.4,25.78
  Bottom/Vert 0.178: v16.51,19.94 15.37,21.08 v10.29,21.08 9.4,21.97 v9.4,25.78

### Text on the board
Bottom/Vert: v10
tDocu: Board thickness is 1.6mm | 4 Layer Board | No clean process | Controlled Impedance: JLC7628 | ENIG Finish | N. Seidle